# Altium project BEAGLEBONEBLACK_REV A5B.PrjPcb (part 2 of 5)

## Sheet P03_Processor 1 of 3, JTAG Header.SchDoc
size 513 x 386 mm
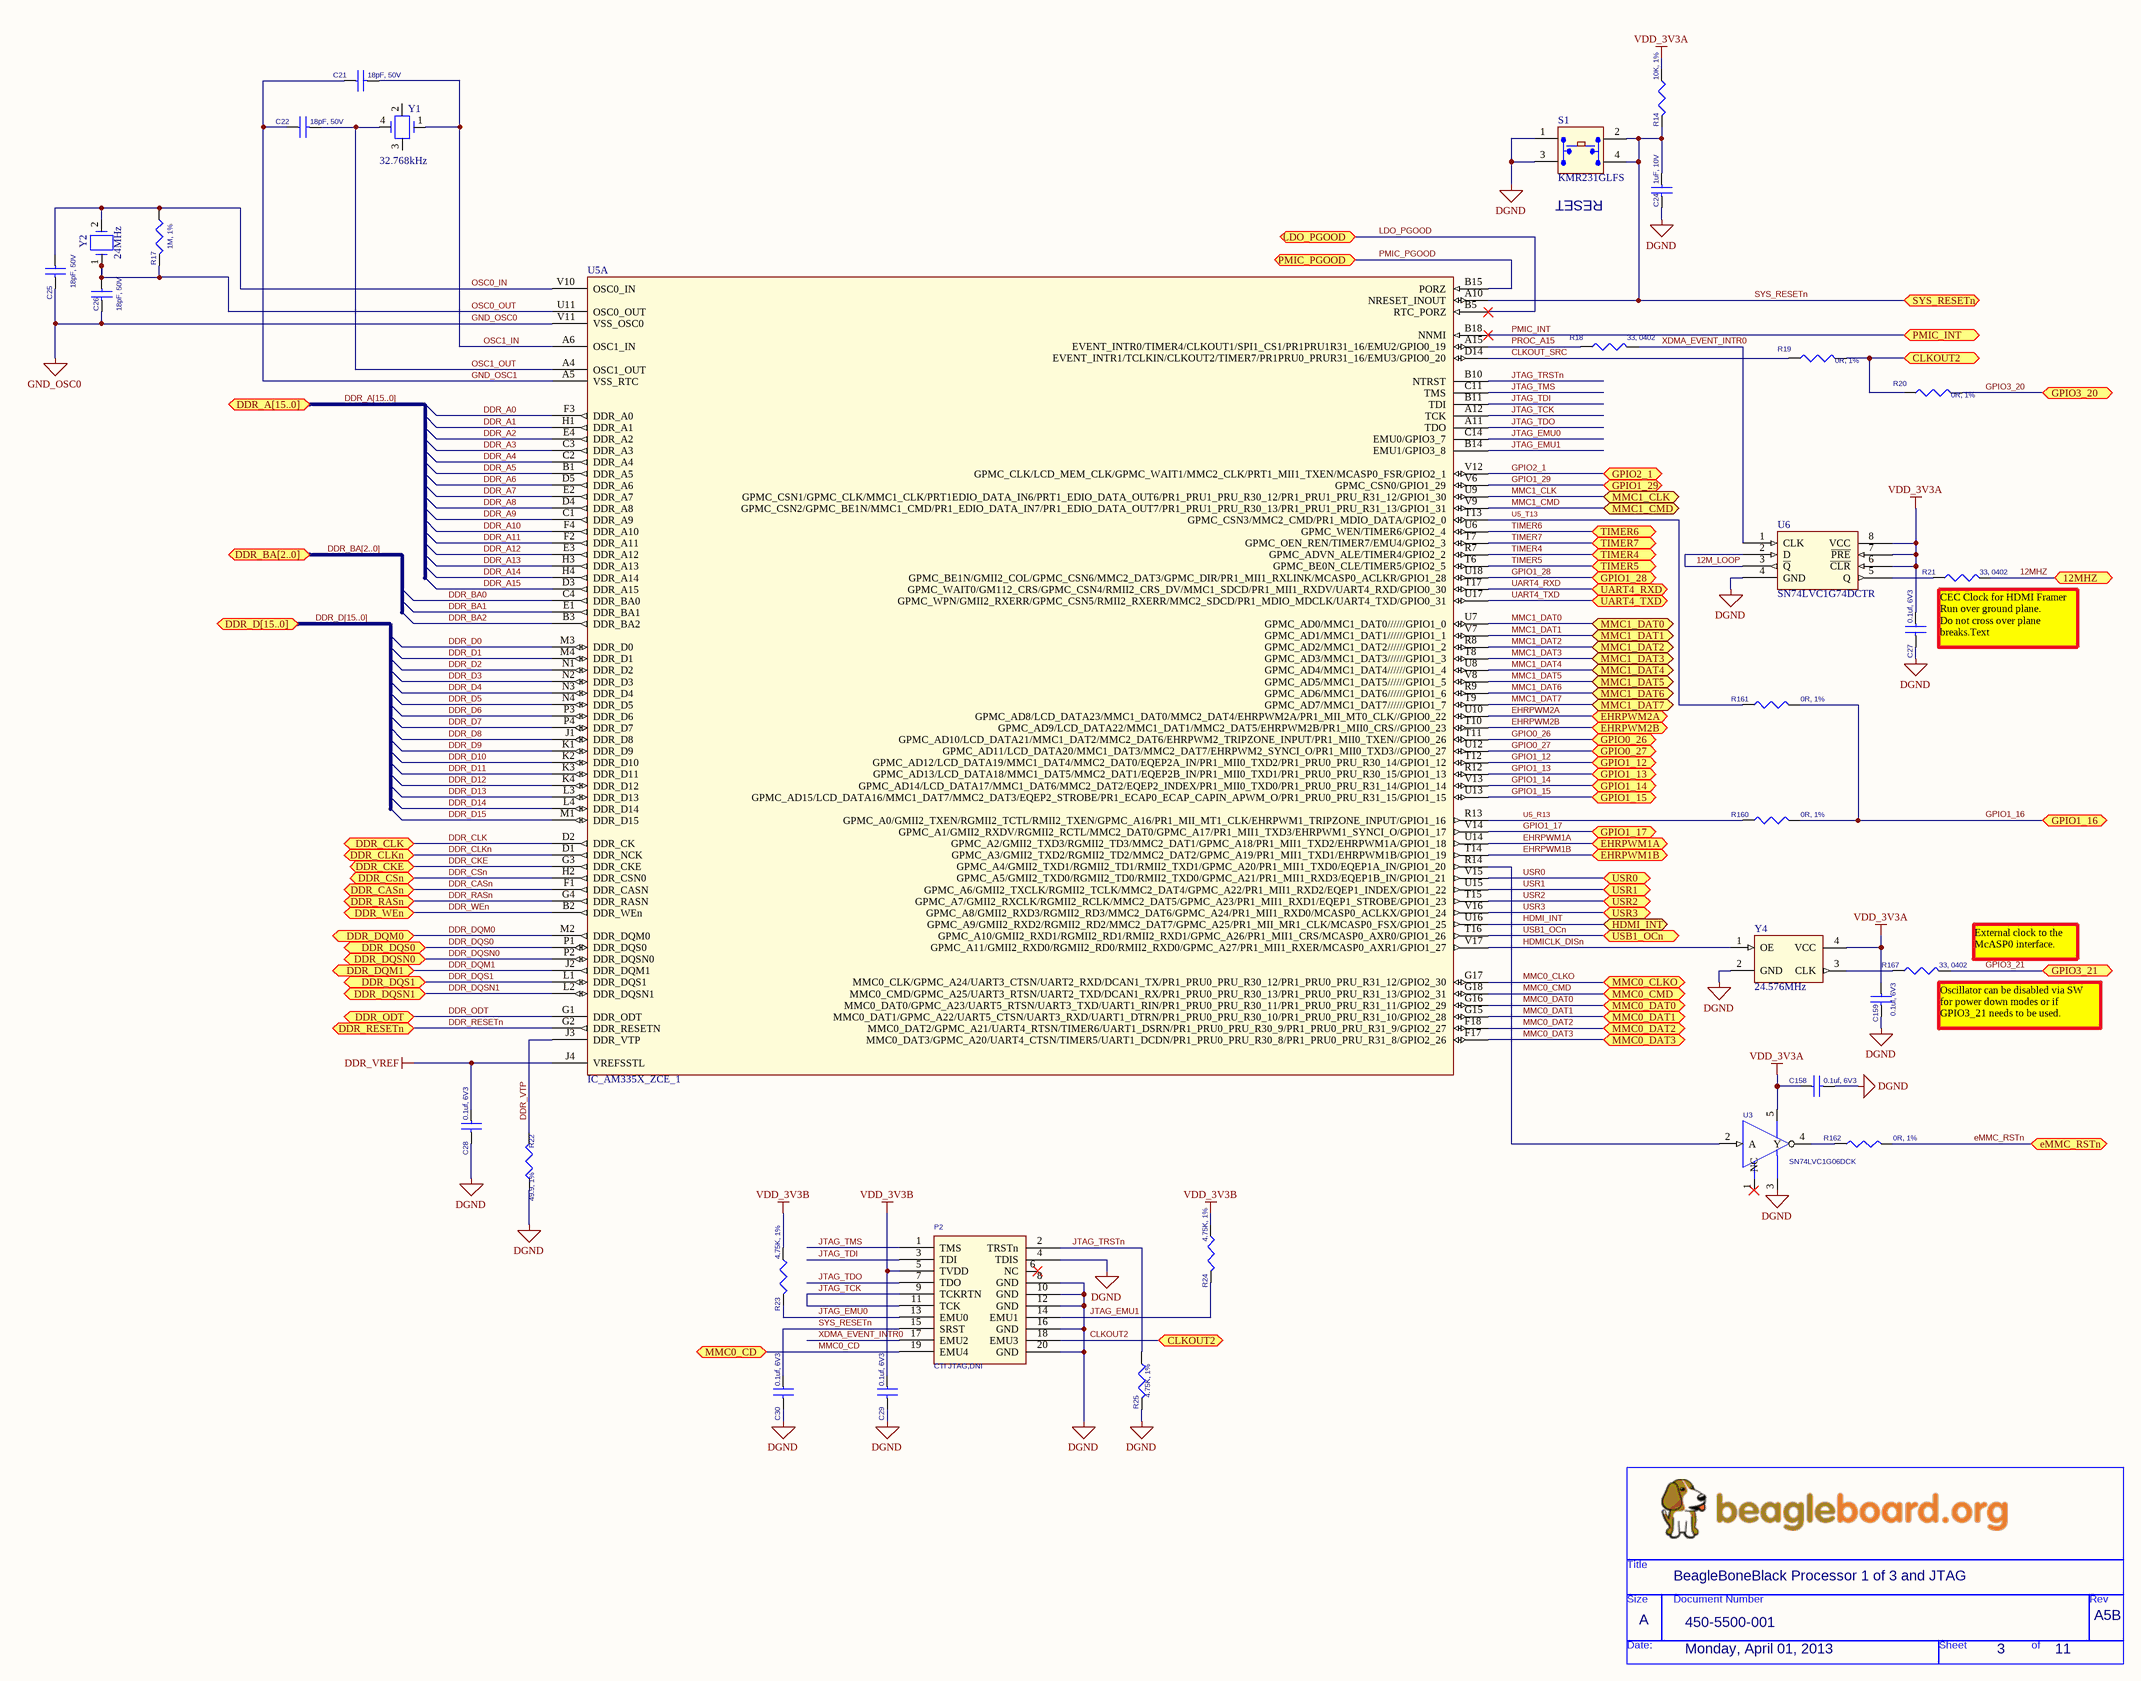
[diagram p2: P03_Processor 1 of 3, JTAG Header.SchDoc]

### Parts
(Parts that share a designator on the sheet are numbered #1, #2 ... from top to bottom, then left to right.)
*#3  Page Create Date: Monday, April 01, 2013  Doc: 450-5500-001  RevCode: A5B  Title: BeagleBoneBlack Processor 1 of 3 and JTAG  Page Size: A  Page Number: 3  Page Count: 11  (hidden comment: BeagleBoard_org)  (graphical)
C21  18pF, 50V  [402]
C22  18pF, 50V  [402]
C24  1uF, 10V  [402]
C25  18pF, 50V  [402]
C26  18pF, 50V  [402]
C27  0.1uf, 6V3  [402]
C28  0.1uf, 6V3  [402]
C29  0.1uf, 6V3  [402]
C30  0.1uf, 6V3  [402]
C158  0.1uf, 6V3  [402]
C159  0.1uf, 6V3  [402]
P2  CTI JTAG,DNI  [HEADER10X2_SMD]
R14  10K, 1%  [402]
R17  1M, 1%  [402]
R18  33, 0402  [402]
R19  0R, 1%  [402]
R20  0R, 1%  [402]
R21  33, 0402  [402]
R22  49.9, 1%  [402]
R23  4.75K, 1%  [402]
R24  4.75K, 1%  [402]
R25  4.75K, 1%  [402]
R160  0R, 1%  [402]
R161  0R, 1%  [402]
R162  0R, 1%  [402]
R167  33, 0402  [402]
S1  KMR231GLFS  [SW4SMD_63X161LS]
U3  SN74LVC1G06DCK  [DCK5_2P15X1P4]
U5  IC_AM335X_ZCE_1  [am33xx_15x15]  (part A of 3)
U6  SN74LVC1G74DCTR  [SOP8_DCT]
Y1  32.768kHz  [XTAL4_126-216SMD]
Y2  24MHz  [XTAL150SMD_125X196]
Y4  24.576MHz  [OSC4_61X65LS_79X98SMD]

### Ports
12MHZ, CLKOUT2, DDR_A[15..0], DDR_BA[2..0], DDR_CASn, DDR_CKE, DDR_CLK, DDR_CLKn, DDR_CSn, DDR_D[15..0], DDR_DQM0, DDR_DQM1, DDR_DQS0, DDR_DQS1, DDR_DQSN0, DDR_DQSN1, DDR_ODT, DDR_RASn, DDR_RESETn, DDR_WEn, EHRPWM1A, EHRPWM1B, EHRPWM2A, EHRPWM2B, eMMC_RSTn, GPIO0_26, GPIO0_27, GPIO1_12, GPIO1_13, GPIO1_14, GPIO1_15, GPIO1_16, GPIO1_17, GPIO1_28, GPIO1_29, GPIO2_1, GPIO3_20, GPIO3_21, HDMI_INT, LDO_PGOOD, MMC0_CD, MMC0_CLKO, MMC0_CMD, MMC0_DAT0, MMC0_DAT1, MMC0_DAT2, MMC0_DAT3, MMC1_CLK, MMC1_CMD, MMC1_DAT0, MMC1_DAT1, MMC1_DAT2, MMC1_DAT3, MMC1_DAT4, MMC1_DAT5, MMC1_DAT6, MMC1_DAT7, PMIC_INT, PMIC_PGOOD, SYS_RESETn, TIMER4, TIMER5, TIMER6, TIMER7, UART4_RXD, UART4_TXD, USB1_OCn, USR0, USR1, USR2, USR3

### Nets
DDR_VREF: C28.1 U5.J4(VREFSSTL)
DGND: C24.2 C27.2 C28.2 C29.2 C30.2 C158.2 C159.2 P2.4(TDIS) P2.8(GND) P2.10(GND) P2.12(GND) P2.16(GND) P2.20(GND) R22.1 R25.2 S1.1(A1) S1.3(A3) U3.3(GND) U6.4(GND) Y4.2(GND)
GND_OSC0: C25.2 C26.2 U5.V11(VSS_OSC0)
VDD_3V3A: C27.1 C158.1 C159.1 R14.1 U3.5(VCC) U6.6(~{CLR}) U6.7(~{PRE}) U6.8(VCC) Y4.4(VCC)
VDD_3V3B: C29.1 P2.5(TVDD) R23.1 R24.1
12M_LOOP: U6.2(D) U6.3(~{Q})
12MHZ: R21.2 ; port 12MHZ
CLKOUT2: P2.18(EMU3) R19.2 R20.1 ; port CLKOUT2
CLKOUT_SRC: R19.1 U5.D14(EVENT_INTR1/TCLKIN/CLKOUT2/TIMER7/PR1PRU0_PRUR31_16/EMU3/GPIO0_20)
DDR_A0: U5.F3(DDR_A0)
DDR_A1: U5.H1(DDR_A1)
DDR_A2: U5.E4(DDR_A2)
DDR_A3: U5.C3(DDR_A3)
DDR_A4: U5.C2(DDR_A4)
DDR_A5: U5.B1(DDR_A5)
DDR_A6: U5.D5(DDR_A6)
DDR_A7: U5.E2(DDR_A7)
DDR_A8: U5.D4(DDR_A8)
DDR_A9: U5.C1(DDR_A9)
DDR_A10: U5.F4(DDR_A10)
DDR_A11: U5.F2(DDR_A11)
DDR_A12: U5.E3(DDR_A12)
DDR_A13: U5.H3(DDR_A13)
DDR_A14: U5.H4(DDR_A14)
DDR_A15: U5.D3(DDR_A15)
DDR_BA0: U5.C4(DDR_BA0)
DDR_BA1: U5.E1(DDR_BA1)
DDR_BA2: U5.B3(DDR_BA2)
DDR_CASn: U5.F1(DDR_CASN) ; port DDR_CASn
DDR_CKE: U5.G3(DDR_CKE) ; port DDR_CKE
DDR_CLK: U5.D2(DDR_CK) ; port DDR_CLK
DDR_CLKn: U5.D1(DDR_NCK) ; port DDR_CLKn
DDR_CSn: U5.H2(DDR_CSN0) ; port DDR_CSn
DDR_D0: U5.M3(DDR_D0)
DDR_D1: U5.M4(DDR_D1)
DDR_D2: U5.N1(DDR_D2)
DDR_D3: U5.N2(DDR_D3)
DDR_D4: U5.N3(DDR_D4)
DDR_D5: U5.N4(DDR_D5)
DDR_D6: U5.P3(DDR_D6)
DDR_D7: U5.P4(DDR_D7)
DDR_D8: U5.J1(DDR_D8)
DDR_D9: U5.K1(DDR_D9)
DDR_D10: U5.K2(DDR_D10)
DDR_D11: U5.K3(DDR_D11)
DDR_D12: U5.K4(DDR_D12)
DDR_D13: U5.L3(DDR_D13)
DDR_D14: U5.L4(DDR_D14)
DDR_D15: U5.M1(DDR_D15)
DDR_DQM0: U5.M2(DDR_DQM0) ; port DDR_DQM0
DDR_DQM1: U5.J2(DDR_DQM1) ; port DDR_DQM1
DDR_DQS0: U5.P1(DDR_DQS0) ; port DDR_DQS0
DDR_DQS1: U5.L1(DDR_DQS1) ; port DDR_DQS1
DDR_DQSN0: U5.P2(DDR_DQSN0) ; port DDR_DQSN0
DDR_DQSN1: U5.L2(DDR_DQSN1) ; port DDR_DQSN1
DDR_ODT: U5.G1(DDR_ODT) ; port DDR_ODT
DDR_RASn: U5.G4(DDR_RASN) ; port DDR_RASn
DDR_RESETn: U5.G2(DDR_RESETN) ; port DDR_RESETn
DDR_VTP: R22.2 U5.J3(DDR_VTP)
DDR_WEn: U5.B2(DDR_WEn) ; port DDR_WEn
EHRPWM1A: U5.U14(GPMC_A2/GMII2_TXD3/RGMII2_TD3/MMC2_DAT1/GPMC_A18/PR1_MII1_TXD2/EHRPWM1A/GPIO1_18) ; port EHRPWM1A
EHRPWM1B: U5.T14(GPMC_A3/GMII2_TXD2/RGMII2_TD2/MMC2_DAT2/GPMC_A19/PR1_MII1_TXD1/EHRPWM1B/GPIO1_19) ; port EHRPWM1B
EHRPWM2A: U5.U10(GPMC_AD8/LCD_DATA23/MMC1_DAT0/MMC2_DAT4/EHRPWM2A/PR1_MII_MT0_CLK//GPIO0_22) ; port EHRPWM2A
EHRPWM2B: U5.T10(GPMC_AD9/LCD_DATA22/MMC1_DAT1/MMC2_DAT5/EHRPWM2B/PR1_MII0_CRS//GPIO0_23) ; port EHRPWM2B
eMMC_RSTn: R162.2 ; port eMMC_RSTn
GND_OSC1: C21.1 C22.1 U5.A5(VSS_RTC)
GPIO0_26: U5.T11(GPMC_AD10/LCD_DATA21/MMC1_DAT2/MMC2_DAT6/EHRPWM2_TRIPZONE_INPUT/PR1_MII0_TXEN//GPIO0_26) ; port GPIO0_26
GPIO0_27: U5.U12(GPMC_AD11/LCD_DATA20/MMC1_DAT3/MMC2_DAT7/EHRPWM2_SYNCI_O/PR1_MII0_TXD3//GPIO0_27) ; port GPIO0_27
GPIO1_12: U5.T12(GPMC_AD12/LCD_DATA19/MMC1_DAT4/MMC2_DAT0/EQEP2A_IN/PR1_MII0_TXD2/PR1_PRU0_PRU_R30_14/GPIO1_12) ; port GPIO1_12
GPIO1_13: U5.R12(GPMC_AD13/LCD_DATA18/MMC1_DAT5/MMC2_DAT1/EQEP2B_IN/PR1_MII0_TXD1/PR1_PRU0_PRU_R30_15/GPIO1_13) ; port GPIO1_13
GPIO1_14: U5.V13(GPMC_AD14/LCD_DATA17/MMC1_DAT6/MMC2_DAT2/EQEP2_INDEX/PR1_MII0_TXD0/PR1_PRU0_PRU_R31_14/GPIO1_14) ; port GPIO1_14
GPIO1_15: U5.U13(GPMC_AD15/LCD_DATA16/MMC1_DAT7/MMC2_DAT3/EQEP2_STROBE/PR1_ECAP0_ECAP_CAPIN_APWM_O/PR1_PRU0_PRU_R31_15/GPIO1_15) ; port GPIO1_15
GPIO1_16: R160.2 R161.2 ; port GPIO1_16
GPIO1_17: U5.V14(GPMC_A1/GMII2_RXDV/RGMII2_RCTL/MMC2_DAT0/GPMC_A17/PR1_MII1_TXD3/EHRPWM1_SYNCI_O/GPIO1_17) ; port GPIO1_17
GPIO1_28: U5.U18(GPMC_BE1N/GMII2_COL/GPMC_CSN6/MMC2_DAT3/GPMC_DIR/PR1_MII1_RXLINK/MCASP0_ACLKR/GPIO1_28) ; port GPIO1_28
GPIO1_29: U5.V6(GPMC_CSN0/GPIO1_29) ; port GPIO1_29
GPIO2_1: U5.V12(GPMC_CLK/LCD_MEM_CLK/GPMC_WAIT1/MMC2_CLK/PRT1_MII1_TXEN/MCASP0_FSR/GPIO2_1) ; port GPIO2_1
GPIO3_20: R20.2 ; port GPIO3_20
GPIO3_21: R167.2 ; port GPIO3_21
HDMI_INT: U5.U16(GPMC_A9/GMII2_RXD2/RGMII2_RD2/MMC2_DAT7/GPMC_A25/PR1_MII_MR1_CLK/MCASP0_FSX/GPIO1_25) ; port HDMI_INT
HDMICLK_DISn: U5.V17(GPMC_A11/GMII2_RXD0/RGMII2_RD0/RMII2_RXD0/GPMC_A27/PR1_MII1_RXER/MCASP0_AXR1/GPIO1_27) Y4.1(OE)
JTAG_EMU0: P2.13(EMU0) R23.2 U5.C14(EMU0/GPIO3_7)
JTAG_EMU1: P2.14(EMU1) R24.2 U5.B14(EMU1/GPIO3_8)
JTAG_TCK: P2.9(TCKRTN) P2.11(TCK) U5.A12(TCK)
JTAG_TDI: P2.3(TDI) U5.B11(TDI)
JTAG_TDO: P2.7(TDO) U5.A11(TDO)
JTAG_TMS: P2.1(TMS) U5.C11(TMS)
JTAG_TRSTn: P2.2(TRSTn) R25.1 U5.B10(NTRST)
LDO_PGOOD: U5.B5(RTC_PORZ) ; port LDO_PGOOD
MMC0_CD: P2.19(EMU4) ; port MMC0_CD
MMC0_CLKO: U5.G17(MMC0_CLK/GPMC_A24/UART3_CTSN/UART2_RXD/DCAN1_TX/PR1_PRU0_PRU_R30_12/PR1_PRU0_PRU_R31_12/GPIO2_30) ; port MMC0_CLKO
MMC0_CMD: U5.G18(MMC0_CMD/GPMC_A25/UART3_RTSN/UART2_TXD/DCAN1_RX/PR1_PRU0_PRU_R30_13/PR1_PRU0_PRU_R31_13/GPIO2_31) ; port MMC0_CMD
MMC0_DAT0: U5.G16(MMC0_DAT0/GPMC_A23/UART5_RTSN/UART3_TXD/UART1_RIN/PR1_PRU0_PRU_R30_11/PR1_PRU0_PRU_R31_11/GPIO2_29) ; port MMC0_DAT0
MMC0_DAT1: U5.G15(MMC0_DAT1/GPMC_A22/UART5_CTSN/UART3_RXD/UART1_DTRN/PR1_PRU0_PRU_R30_10/PR1_PRU0_PRU_R31_10/GPIO2_28) ; port MMC0_DAT1
MMC0_DAT2: U5.F18(MMC0_DAT2/GPMC_A21/UART4_RTSN/TIMER6/UART1_DSRN/PR1_PRU0_PRU_R30_9/PR1_PRU0_PRU_R31_9/GPIO2_27) ; port MMC0_DAT2
MMC0_DAT3: U5.F17(MMC0_DAT3/GPMC_A20/UART4_CTSN/TIMER5/UART1_DCDN/PR1_PRU0_PRU_R30_8/PR1_PRU0_PRU_R31_8/GPIO2_26) ; port MMC0_DAT3
MMC1_CLK: U5.U9(GPMC_CSN1/GPMC_CLK/MMC1_CLK/PRT1EDIO_DATA_IN6/PRT1_EDIO_DATA_OUT6/PR1_PRU1_PRU_R30_12/PR1_PRU1_PRU_R31_12/GPIO1_30) ; port MMC1_CLK
MMC1_CMD: U5.V9(GPMC_CSN2/GPMC_BE1N/MMC1_CMD/PR1_EDIO_DATA_IN7/PR1_EDIO_DATA_OUT7/PR1_PRU1_PRU_R30_13/PR1_PRU1_PRU_R31_13/GPIO1_31) ; port MMC1_CMD
MMC1_DAT0: U5.U7(GPMC_AD0/MMC1_DAT0//////GPIO1_0) ; port MMC1_DAT0
MMC1_DAT1: U5.V7(GPMC_AD1/MMC1_DAT1//////GPIO1_1) ; port MMC1_DAT1
MMC1_DAT2: U5.R8(GPMC_AD2/MMC1_DAT2//////GPIO1_2) ; port MMC1_DAT2
MMC1_DAT3: U5.T8(GPMC_AD3/MMC1_DAT3//////GPIO1_3) ; port MMC1_DAT3
MMC1_DAT4: U5.U8(GPMC_AD4/MMC1_DAT4//////GPIO1_4) ; port MMC1_DAT4
MMC1_DAT5: U5.V8(GPMC_AD5/MMC1_DAT5//////GPIO1_5) ; port MMC1_DAT5
MMC1_DAT6: U5.R9(GPMC_AD6/MMC1_DAT6//////GPIO1_6) ; port MMC1_DAT6
MMC1_DAT7: U5.T9(GPMC_AD7/MMC1_DAT7//////GPIO1_7) ; port MMC1_DAT7
OSC0_IN: C25.1 R17.1 U5.V10(OSC0_IN) Y2.2
OSC0_OUT: C26.1 R17.2 U5.U11(OSC0_OUT) Y2.1
OSC1_IN: C21.2 U5.A6(OSC1_IN) Y1.1
OSC1_OUT: C22.2 U5.A4(OSC1_OUT) Y1.4
PMIC_INT: U5.B18(NNMI) ; port PMIC_INT
PMIC_PGOOD: U5.B15(PORZ) ; port PMIC_PGOOD
PROC_A15: R18.1 U5.A15(EVENT_INTR0/TIMER4/CLKOUT1/SPI1_CS1/PR1PRU1R31_16/EMU2/GPIO0_19)
SYS_RESETn: C24.1 C30.1 P2.15(SRST) R14.2 S1.2(A2) S1.4 U5.A10(NRESET_INOUT) ; port SYS_RESETn
TIMER4: U5.R7(GPMC_ADVN_ALE/TIMER4/GPIO2_2) ; port TIMER4
TIMER5: U5.T6(GPMC_BE0N_CLE/TIMER5/GPIO2_5) ; port TIMER5
TIMER6: U5.U6(GPMC_WEN/TIMER6/GPIO2_4) ; port TIMER6
TIMER7: U5.T7(GPMC_OEN_REN/TIMER7/EMU4/GPIO2_3) ; port TIMER7
U5_R13: R160.1 U5.R13(GPMC_A0/GMII2_TXEN/RGMII2_TCTL/RMII2_TXEN/GPMC_A16/PR1_MII_MT1_CLK/EHRPWM1_TRIPZONE_INPUT/GPIO1_16)
U5_T13: R161.1 U5.T13(GPMC_CSN3/MMC2_CMD/PR1_MDIO_DATA/GPIO2_0)
UART4_RXD: U5.T17(GPMC_WAIT0/GM112_CRS/GPMC_CSN4/RMII2_CRS_DV/MMC1_SDCD/PR1_MII1_RXDV/UART4_RXD/GPIO0_30) ; port UART4_RXD
UART4_TXD: U5.U17(GPMC_WPN/GMII2_RXERR/GPMC_CSN5/RMII2_RXERR/MMC2_SDCD/PR1_MDIO_MDCLK/UART4_TXD/GPIO0_31) ; port UART4_TXD
USB1_OCn: U5.T16(GPMC_A10/GMII2_RXD1/RGMII2_RD1/RMII2_RXD1/GPMC_A26/PR1_MII1_CRS/MCASP0_AXR0/GPIO1_26) ; port USB1_OCn
USR0: U5.V15(GPMC_A5/GMII2_TXD0/RGMII2_TD0/RMII2_TXD0/GPMC_A21/PR1_MII1_RXD3/EQEP1B_IN/GPIO1_21) ; port USR0
USR1: U5.U15(GPMC_A6/GMII2_TXCLK/RGMII2_TCLK/MMC2_DAT4/GPMC_A22/PR1_MII1_RXD2/EQEP1_INDEX/GPIO1_22) ; port USR1
USR2: U5.T15(GPMC_A7/GMII2_RXCLK/RGMII2_RCLK/MMC2_DAT5/GPMC_A23/PR1_MII1_RXD1/EQEP1_STROBE/GPIO1_23) ; port USR2
USR3: U5.V16(GPMC_A8/GMII2_RXD3/RGMII2_RD3/MMC2_DAT6/GPMC_A24/PR1_MII1_RXD0/MCASP0_ACLKX/GPIO1_24) ; port USR3
XDMA_EVENT_INTR0: P2.17(EMU2) R18.2 U6.1(CLK)
NetR21_1: R21.1 U6.5(Q)
NetR162_1: R162.1 U3.4(Y)
NetR167_1: R167.1 Y4.3(CLK)
NetU3_2: U3.2(A) U5.R14(GPMC_A4/GMII2_TXD1/RGMII2_TD1/RMII2_TXD1/GPMC_A20/PR1_MII1_TXD0/EQEP1A_IN/GPIO1_20)

Not connected (* = marked no-connect by the designer): P2 6(NC)*; U3 1(NC)*; Y1 2 3

### Buses and harness runs
bus DDR_A[15..0] = port DDR_A[15..0]
bus DDR_BA[2..0] = port DDR_BA[2..0]
bus DDR_D[15..0] = port DDR_D[15..0]

### Notes on the sheet
- (near S1) RESET
- (near R21) CEC Clock for HDMI Framer
  Run over ground plane.
  Do not cross over plane
  breaks.Text
- (near R167) External clock to the
  McASP0 interface.
- (near R167) Oscillator can be disabled via SW
  for power down modes or if
  GPIO3_21 needs to be used.
- (in symbol BeagleBoard_org) Title; Size; Document Number; Rev; Date:; Sheet; of

### Library data of the parts
C21 C22 C25 C26 = CAP_18PF_COG_50V_5%_0402: CAP CER 18PF 50V 5% NP0 0402; Manufacturer: TDK Corporation; Manufacturer Part Number: C1005C0G1H180J050BA; Temperature Coefficient: C0G, NP0; Supplier 1: Digi-Key; Supplier Part Number 1: 445-1238-6-ND; RoHS: RoHS Compliant; Category: Capacitors; Stock 1: 352554; Pricing 1: 1=0.1, 10=0.024, 100=0.011, 250=0.009, 500=0.0077, 1000=0.006, 5000=0.005 (USD); Capacitance: 18pF; Voltage - Rated: 50V; Tolerance: ±5%; Mounting Type: Surface Mount, MLCC; Operating Temperature: -55°C ~ 125°C; Applications: General Purpose; Ratings: -; Package / Case: 0402 (1005 Metric); Size / Dimension: 0.039" L x 0.020" W (1.00mm x 0.50mm); Height - Seated (Max): -; Thickness (Max): 0.022" (0.55mm); Lead Spacing: -; Features: -; Packaging: Digi-Reel®; Lead Style: -; ComponentLink1URL: http://product.tdk.com/capacitor/mlcc/en/documents/mlcc_commercial_general_en.pdf; ComponentLink1Description: http://product.tdk.com/capacitor/mlcc/en/documents/mlcc_commercial_general_en.pdf
C24 = CAP_1.0UF_X5R_10V_10%_0402: CAP CER 1UF 10V 10% X5R 0402; Manufacturer: AVX Corporation; Manufacturer Part Number: 0402ZD105KAT2A; Capacitance: 1.0µF; Applications: General Purpose; Category: Capacitors; ComponentLink1Description: http://www.avx.com/docs/Catalogs/cx5r.pdf; ComponentLink1URL: http://www.avx.com/docs/Catalogs/cx5r.pdf; Features: -; Height - Seated (Max): -; Lead Spacing: -; Lead Style: -; Mounting Type: Surface Mount, MLCC; Operating Temperature: -55°C ~ 85°C; Package / Case: 0402 (1005 Metric); Packaging: Digi-Reel®; Pricing 1: 1=0.3, 10=0.25, 100=0.125, 250=0.09376, 500=0.08282, 1000=0.07344, 5000=0.06094 (USD); Ratings: -; RoHS: RoHS Compliant; Size / Dimension: 0.039" L x 0.020" W (1.00mm x 0.50mm); Stock 1: 409277; Supplier 1: Digi-Key; Supplier Part Number 1: 478-4596-6-ND; Temperature Coefficient: X5R; Thickness (Max): 0.022" (0.56mm); Tolerance: ±10%; Voltage - Rated: 10V
C27-C30 C158 C159 = CAP_0.1uF_X7R_16V_10% 0402: CAP CER 0.1UF 6.3V 10% X5R 0402; Manufacturer: TDK Corporation; Manufacturer Part Number: C1005X5R0J104K050BA; Capacitance: 0.1µF; Supplier 1: Digi-Key; Supplier Part Number 1: 445-1266-6-ND; RoHS: RoHS Compliant; Category: Capacitors; Pricing 1: 1=0.1, 10=0.026, 100=0.0121, 250=0.00992, 500=0.00848, 1000=0.0066, 5000=0.0055 (USD); Voltage - Rated: 6.3V; Tolerance: ±10%; Temperature Coefficient: X5R; Mounting Type: Surface Mount, MLCC; Operating Temperature: -55°C ~ 85°C; Applications: General Purpose; Ratings: -; Package / Case: 0402 (1005 Metric); Size / Dimension: 0.039" L x 0.020" W (1.00mm x 0.50mm); Height - Seated (Max): -; Thickness (Max): 0.022" (0.55mm); Lead Spacing: -; Features: -; Packaging: Digi-Reel®; Lead Style: -; ComponentLink1URL: http://product.tdk.com/capacitor/mlcc/en/documents/mlcc_commercial_general_en.pdf; ComponentLink1Description: http://product.tdk.com/capacitor/mlcc/en/documents/mlcc_commercial_general_en.pdf
  C27-C29 C158 C159: Stock 1: 137886
  C30: Stock 1: 127604
P2 = HDR_10x2_CJTAG: Dual Line Header 10x2pin Tin; Manufacturer: Samtec Inc; Manufacturer Part Number: FTR-110-03-G-D-06; Connector Type: Unshrouded; Number of Positions: 20; Number of Positions Loaded: 19; Pitch: 0.050" (1.27mm); Row Spacing: 0.100" (2.54mm); Supplier 1: Digi-Key; Supplier Part Number 1: FTR-110-03-G-D-06-ND; RoHS: RoHS Compliant; Category: Connectors, Interconnects; Stock 1: 0; Pricing 1: 1=4.47 (USD); Number of Rows: 2; Height Stacking (Mating): -; Molding Height Above Board: 0.100" (2.54mm); Contact Mating Length: 0.125" (3.18mm); Mounting Type: Surface Mount; Termination: Solder; Contact Finish: Gold; Contact Finish Thickness: 10µin (0.25µm); Features: -; Color: Black; Packaging: Tube; ComponentLink1URL: http://www.samtec.com/documents/webfiles/cpdf/FTR-1XX-XX-XX-D-X-XX-MKT.pdf; ComponentLink1Description: http://www.samtec.com/documents/webfiles/cpdf/FTR-1XX-XX-XX-D-X-XX-MKT.pdf
R14 = RES_10K_1/16W_1%_0402: RES 10K OHM 1/16W 5% 0402 SMD; Manufacturer: Rohm Semiconductor; Manufacturer Part Number: MCR01MZPJ103; Power (Watts): 0.063W, 1/16W; Temperature Coefficient: ±200ppm/°C; Supplier 1: Digi-Key; Supplier Part Number 1: RHM10KJDKR-ND; RoHS: RoHS Compliant; Category: Resistors; Stock 1: 110842; Pricing 1: 1=0.1, 10=0.019, 25=0.014, 100=0.0078, 250=0.00596, 500=0.00476, 1000=0.0035, 5000=0.00251 (USD); Resistance (Ohms): 10k; Composition: Thick Film; Features: Automotive AEC-Q200 Qualified; Tolerance: ±5%; Package / Case: 0402 (1005 Metric); Supplier Device Package: 0402 (1005 Metric); Size / Dimension: 0.039" L x 0.020" W (1.00mm x 0.50mm); Height: 0.016" (0.40mm); Number of Terminations: 2; Packaging: Digi-Reel®; ComponentLink1URL: http://rohmfs.rohm.com/en/products/databook/datasheet/passive/resistor/chip_resistor/mcr_a.pdf; ComponentLink1Description: http://rohmfs.rohm.com/en/products/databook/datasheet/passive/resistor/chip_resistor/mcr_a.pdf
R17 = RES_1M_1/16W_1%_0402: Resistor 1Mohm 1/16W 1% 0402; Manufacturer: Stackpole Electronics Inc; Manufacturer Part Number: RMCF0402FT1M00; Power (Watts): 0.063W, 1/16W; Temperature Coefficient: ±100ppm/°C; Supplier 1: Digi-Key; Supplier Part Number 1: RMCF0402FT1M00DKR-ND; RoHS: RoHS Compliant; Category: Resistors; Stock 1: 175650; Pricing 1: 1=0.04, 10=0.025, 50=0.0138, 100=0.0105, 250=0.0078, 500=0.00576, 1000=0.00384, 2500=0.00324, 5000=0.0027 (USD); Resistance (Ohms): 1M; Composition: Thick Film; Features: -; Tolerance: ±1%; Package / Case: 0402 (1005 Metric); Supplier Device Package: 0402; Size / Dimension: 0.039" L x 0.020" W (1.00mm x 0.50mm); Height: 0.016" (0.40mm); Number of Terminations: 2; Packaging: Digi-Reel®; ComponentLink1URL: http://www.seielect.com/Catalog/SEI-RMCF_RMCP.pdf; ComponentLink1Description: http://www.seielect.com/Catalog/SEI-RMCF_RMCP.pdf
R18 R21 R167 = RES_33_0402: RES 33 OHM 1/16W 5% 0402 SMD; Manufacturer: Panasonic Electronic Components; Manufacturer Part Number: ERJ-2GEJ330X; Resistance (Ohms): 33; Power (Watts): 0.1W, 1/10W; Temperature Coefficient: ±200ppm/°C; Supplier 1: Digi-Key; Supplier Part Number 1: P33JDKR-ND; RoHS: RoHS Compliant; Category: Resistors; Stock 1: 5879945; Pricing 1: 1=0.1, 50=0.0172, 100=0.0131, 250=0.00976, 500=0.0072, 1000=0.0048, 5000=0.00338 (USD); Composition: Thick Film; Features: -; Tolerance: ±5%; Package / Case: 0402 (1005 Metric); Supplier Device Package: 0402; Size / Dimension: 0.039" L x 0.020" W (1.00mm x 0.50mm); Height: 0.016" (0.40mm); Number of Terminations: 2; Packaging: Digi-Reel®; ComponentLink1URL: http://industrial.panasonic.com/www-cgi/jvcr13pz.cgi?E+PZ+3+AOA0001+ERJ2GEJ330X+7+WW; ComponentLink1Description: http://industrial.panasonic.com/www-cgi/jvcr13pz.cgi?E+PZ+3+AOA0001+ERJ2GEJ330X+7+WW
R19 R20 R160-R162 = RES_0_1/16W_1%_0402: RES 0.0 OHM 1/16W 0402 SMD; Manufacturer: Yageo; Manufacturer Part Number: RC0402JR-070RL; Resistance (Ohms): 0.0; Power (Watts): 0.063W, 1/16W; Tolerance: Jumper; Supplier 1: Digi-Key; Supplier Part Number 1: 311-0.0JRDKR-ND; RoHS: RoHS Compliant; Category: Resistors; Stock 1: 4904429; Pricing 1: 1=0.1, 10=0.012, 25=0.0092, 100=0.0055, 250=0.00476, 500=0.00336, 1000=0.00237, 2500=0.00206, 5000=0.00178 (USD); Composition: Thick Film; Features: -; Temperature Coefficient: -; Package / Case: 0402 (1005 Metric); Supplier Device Package: 0402; Size / Dimension: 0.039" L x 0.020" W (1.00mm x 0.50mm); Height: 0.016" (0.40mm); Number of Terminations: 2; Packaging: Digi-Reel®; ComponentLink1URL: http://www.yageo.com/documents/recent/PYu-RC0402_51_RoHS_L_6.pdf; ComponentLink1Description: http://www.yageo.com/documents/recent/PYu-RC0402_51_RoHS_L_6.pdf
R22 = RES_4.7K_0402: RES 49.9 OHM 1/16W 1% 0402 SMD; Manufacturer: Yageo; Manufacturer Part Number: RC0402FR-0749R9L; Resistance (Ohms): 49.9; Power (Watts): 0.063W, 1/16W; Temperature Coefficient: ±100ppm/°C; Supplier 1: Digi-Key; Supplier Part Number 1: 311-49.9LRDKR-ND; RoHS: RoHS Compliant; Category: Resistors; Stock 1: 1338786; Pricing 1: 1=0.1, 10=0.014, 25=0.0104, 100=0.0063, 250=0.0054, 500=0.00382, 1000=0.0027, 2500=0.00234, 5000=0.00203 (USD); Composition: Thick Film; Features: -; Tolerance: ±1%; Package / Case: 0402 (1005 Metric); Supplier Device Package: 0402; Size / Dimension: 0.039" L x 0.020" W (1.00mm x 0.50mm); Height: 0.016" (0.40mm); Number of Terminations: 2; Packaging: Digi-Reel®; ComponentLink1URL: http://www.yageo.com/documents/recent/PYu-RC0402_51_RoHS_L_6.pdf; ComponentLink1Description: http://www.yageo.com/documents/recent/PYu-RC0402_51_RoHS_L_6.pdf
R23-R25 = RES_4.7K_0402: RES 4.75K 1/16W 1% 0402 SMD; Manufacturer: Stackpole Electronics Inc; Manufacturer Part Number: RMCF0402FT4K75; Power (Watts): 0.063W, 1/16W; Temperature Coefficient: ±100ppm/°C; Supplier 1: Digi-Key; Supplier Part Number 1: RMCF0402FT4K75DKR-ND; RoHS: RoHS Compliant; Category: Resistors; Stock 1: 280611; Pricing 1: 1=0.04, 10=0.025, 50=0.0138, 100=0.0105, 250=0.0078, 500=0.00576, 1000=0.00384, 2500=0.00324, 5000=0.0027 (USD); Resistance (Ohms): 4.75k; Composition: Thick Film; Features: -; Tolerance: ±1%; Package / Case: 0402 (1005 Metric); Supplier Device Package: 0402; Size / Dimension: 0.039" L x 0.020" W (1.00mm x 0.50mm); Height: 0.016" (0.40mm); Number of Terminations: 2; Packaging: Digi-Reel®; ComponentLink1URL: http://www.seielect.com/Catalog/SEI-RMCF_RMCP.pdf; ComponentLink1Description: http://www.seielect.com/Catalog/SEI-RMCF_RMCP.pdf
S1 = KMR2: Microminiature Tact Switch for SMT; Manufacturer: C&K Components; Circuit: SPST-NO; Switch Function: Off-Mom; Contact Rating @ Voltage: 0.05A @ 32VDC; Actuator Type: Standard; Actuator Height off PCB, from Pins: 1.90mm; Actuator Orientation: Top Actuated; Outline: 4.60mm x 2.80mm; Illumination: Non-Illuminated; Operating Force: 300gf; Switch Travel: 0.25mm; Mechanical Life: 150,000 Cycles; Supplier 1: Digi-Key; Supplier Part Number 1: 401-1429-6-ND; Manufacturer Part Number: KMR231GLFS; RoHS: RoHS Compliant; Category: Switches; Stock 1: 32289; Pricing 1: 1=0.44, 10=0.416, 25=0.3744, 50=0.3326, 100=0.3188, 250=0.29108, 500=0.2772, 1000=0.22869 (USD); Mounting Type: Surface Mount; Termination Style: Gull Wing; Illumination Voltage (Nominal): -; Illumination Type, Color: -; Ingress Protection: -; Features: Grounding Pin; Packaging: Digi-Reel®; Actuator Material: -; Operating Temperature: -40°C ~ 85°C; ComponentLink1URL: http://www.ck-components.com/index.php?module=media&action=Display&cmpref=14414&lang=en&width=&height=&format=&alt=; ComponentLink1Description: http://www.ck-components.com/index.php?module=media&action=Display&cmpref=14414&lang=en&width=&height=&format=&alt=
U3 = SN74LVC1G06DCK: IC INVERTER SINGLE 1INPUT SC705; Manufacturer: Texas Instruments; Manufacturer Part Number: SN74LVC1G06DCKTG4; Logic Type: Inverter, Buffer; Number of Circuits: 1; Voltage - Supply: 1.65 V ~ 5.5 V; Current - Quiescent (Max): 10µA; Current - Output High, Low: -, 32mA; Logic Level - Low: 0.7 V ~ 0.8 V; Logic Level - High: 1.7 V ~ 2 V; Max Propagation Delay @ V, Max CL: 3ns @ 5V, 50pF; Supplier 1: Digi-Key; Supplier Part Number 1: SN74LVC1G06DCKTG4-ND; RoHS: RoHS Compliant; Category: Integrated Circuits (ICs); Stock 1: 0; Pricing 1: 1250=0.32 (USD); Number of Inputs: 1; Features: Open Drain; Operating Temperature: -40°C ~ 85°C; Mounting Type: Surface Mount; Supplier Device Package: SC-70-5; Package / Case: 6-TSSOP (5 Lead), SC-88A, SOT-353; Packaging: Tape & Reel (TR); ComponentLink1URL: http://www.ti.com/lit/ds/symlink/sn74lvc1g06.pdf; ComponentLink1Description: http://www.ti.com/lit/ds/symlink/sn74lvc1g06.pdf
U5 = IC_AM335X_ZCE_1: SubArctic Cortex A8 Processor 15x15; Manufacturer: Texas Instruments; Manufacturer Part Number: XAM3359ZCZ; Processor Type: ARM Microprocessor; Voltage: 1.06 V ~ 1.15 V; Supplier 1: Digi-Key; Supplier Part Number 1: 296-35073-ND; RoHS: RoHS Compliant; Category: Integrated Circuits (ICs); Stock 1: 16; Pricing 1: 1=33.5, 10=30.988, 100=26.465, 250=24.28752, 500=23.115, 1000=21.775, 2500=21.105, 5000=20.6025, 10000=20.1 (USD); Features: -; Speed: -; Mounting Type: Surface Mount; Package / Case: 324-LFBGA; Supplier Device Package: 324-NFBGA(15x15); Packaging: Tray; ComponentLink1URL: http://www.ti.com/lit/ds/symlink/am3354.pdf; ComponentLink1Description: http://www.ti.com/lit/ds/symlink/am3354.pdf
U6 = SN74LVC1G74DCTR: SINGLE  POSITIVE-EDGE-TRIGGERED  D-TYPE  FLIP-FLOP WITH  CLEAR  AND  PRESET; Manufacturer: Texas Instruments; Function: Set(Preset) and Reset; Output Type: Differential; Number of Elements: 1; Frequency - Clock: 200MHz; Delay Time - Propagation: 1.6ns; Trigger Type: Positive Edge; Current - Output High, Low: 32mA, 32mA; Voltage - Supply: 1.65 V ~ 5.5 V; Supplier 1: Digi-Key; Supplier Part Number 1: 296-25553-6-ND; Manufacturer Part Number: SN74LVC1G74DCTR; RoHS: RoHS Compliant; Category: Integrated Circuits (ICs); Stock 1: 131; Pricing 1: 1=0.59, 10=0.494, 25=0.4332, 100=0.3708, 250=0.3216, 500=0.2724, 1000=0.21 (USD); Type: D-Type; Number of Bits per Element: 1; Operating Temperature: -40°C ~ 125°C; Mounting Type: Surface Mount; Package / Case: 8-LSSOP (0.11", 2.80mm Width); Packaging: Digi-Reel®; ComponentLink1URL: http://media.digikey.com/pdf/Data%20Sheets/Texas%20Instruments%20PDFs/SN74LVC1G74.pdf; ComponentLink1Description: http://media.digikey.com/pdf/Data%20Sheets/Texas%20Instruments%20PDFs/SN74LVC1G74.pdf
Y1 = CRYS_32_768KHz_SMD32: CRYSTAL 32.768KHZ 12.5PF SMD; Manufacturer: Citizen Finetech Miyota; Manufacturer Part Number: CM200C-32.768KAZF-UT; Frequency Tolerance: ±30ppm; ESR (Equivalent Series Resistance): 50 kOhm; Operating Mode: Fundamental; Supplier 1: Digi-Key; Supplier Part Number 1: 300-8738-6-ND; RoHS: RoHS Compliant; Category: Crystals and Oscillators; Stock 1: 0; Pricing 1: 1=0.75, 10=0.65, 50=0.57, 100=0.45, 500=0.38, 1000=0.3 (USD); Type: kHz Crystal (Tuning Fork); Frequency: 32.768kHz; Frequency Stability: -; Load Capacitance: 12.5pF; Operating Temperature: -40°C ~ 85°C; Ratings: -; Mounting Type: Surface Mount; Package / Case: 4-SOJ, 5.50mm pitch; Size / Dimension: 0.311" L x 0.146" W (7.90mm x 3.70mm); Height: 0.098" (2.50mm); Packaging: Digi-Reel®; ComponentLink1URL: http://cfm.citizen.co.jp/english/product/pdf/CM200C_250C.pdf; ComponentLink1Description: http://cfm.citizen.co.jp/english/product/pdf/CM200C_250C.pdf
Y2 = CRYS_24MHz_SCC: CRYSTAL 24.000MHZ 18PF SMD; Manufacturer: TXC CORPORATION; Manufacturer Part Number: 7A-24.000MAAJ-T; Frequency Stability: ±30ppm; ESR (Equivalent Series Resistance): 50 Ohm; Operating Mode: Fundamental; Supplier 1: Digi-Key; Supplier Part Number 1: 887-1090-6-ND; RoHS: RoHS Compliant; Category: Crystals and Oscillators; Stock 1: 2524; Pricing 1: 1=0.79, 10=0.658, 50=0.59, 100=0.525, 500=0.5 (USD); Type: MHz Crystal; Frequency: 24MHz; Frequency Tolerance: ±30ppm; Load Capacitance: 18pF; Operating Temperature: -20°C ~ 70°C; Ratings: -; Mounting Type: Surface Mount; Package / Case: 2-SMD; Size / Dimension: 0.197" L x 0.126" W (5.00mm x 3.20mm); Height: 0.053" (1.35mm); Packaging: Digi-Reel®; ComponentLink1URL: http://www.txccrystal.com/images/pdf/7a.pdf; ComponentLink1Description: http://www.txccrystal.com/images/pdf/7a.pdf
Y4 = ASDMB: Manufacturer: Abracon Corporation; Manufacturer Part Number: ASDMB-24.576MHZ-LC-T; Function: Standby (Power Down); Output: CMOS; Voltage - Supply: 1.8 V ~ 3.3 V; Frequency Stability: ±50ppm; Current - Supply (Max): 16mA; Current - Supply (Disable) (Max): 15µA; Supplier 1: Digi-Key; Supplier Part Number 1: 535-11729-6-ND; RoHS: RoHS Compliant; Category: Crystals and Oscillators; Stock 1: 0; Pricing 1: 1=1.69, 10=1.463, 50=1.2826, 100=1.0125, 500=0.855 (USD); Type: MEMS (Silicon); Frequency: 24.576MHz; Operating Temperature: -40°C ~ 85°C; Ratings: -; Mounting Type: Surface Mount; Size / Dimension: 0.098" L x 0.079" W (2.50mm x 2.00mm); Height: 0.035" (0.90mm); Package / Case: 4-SMD, No Lead (DFN, LCC); Packaging: Digi-Reel®; ComponentLink1URL: http://www.abracon.com/Oscillators/ASDMB.pdf; ComponentLink1Description: http://www.abracon.com/Oscillators/ASDMB.pdf